# Altium project 4_3 LCD.PrjPcb
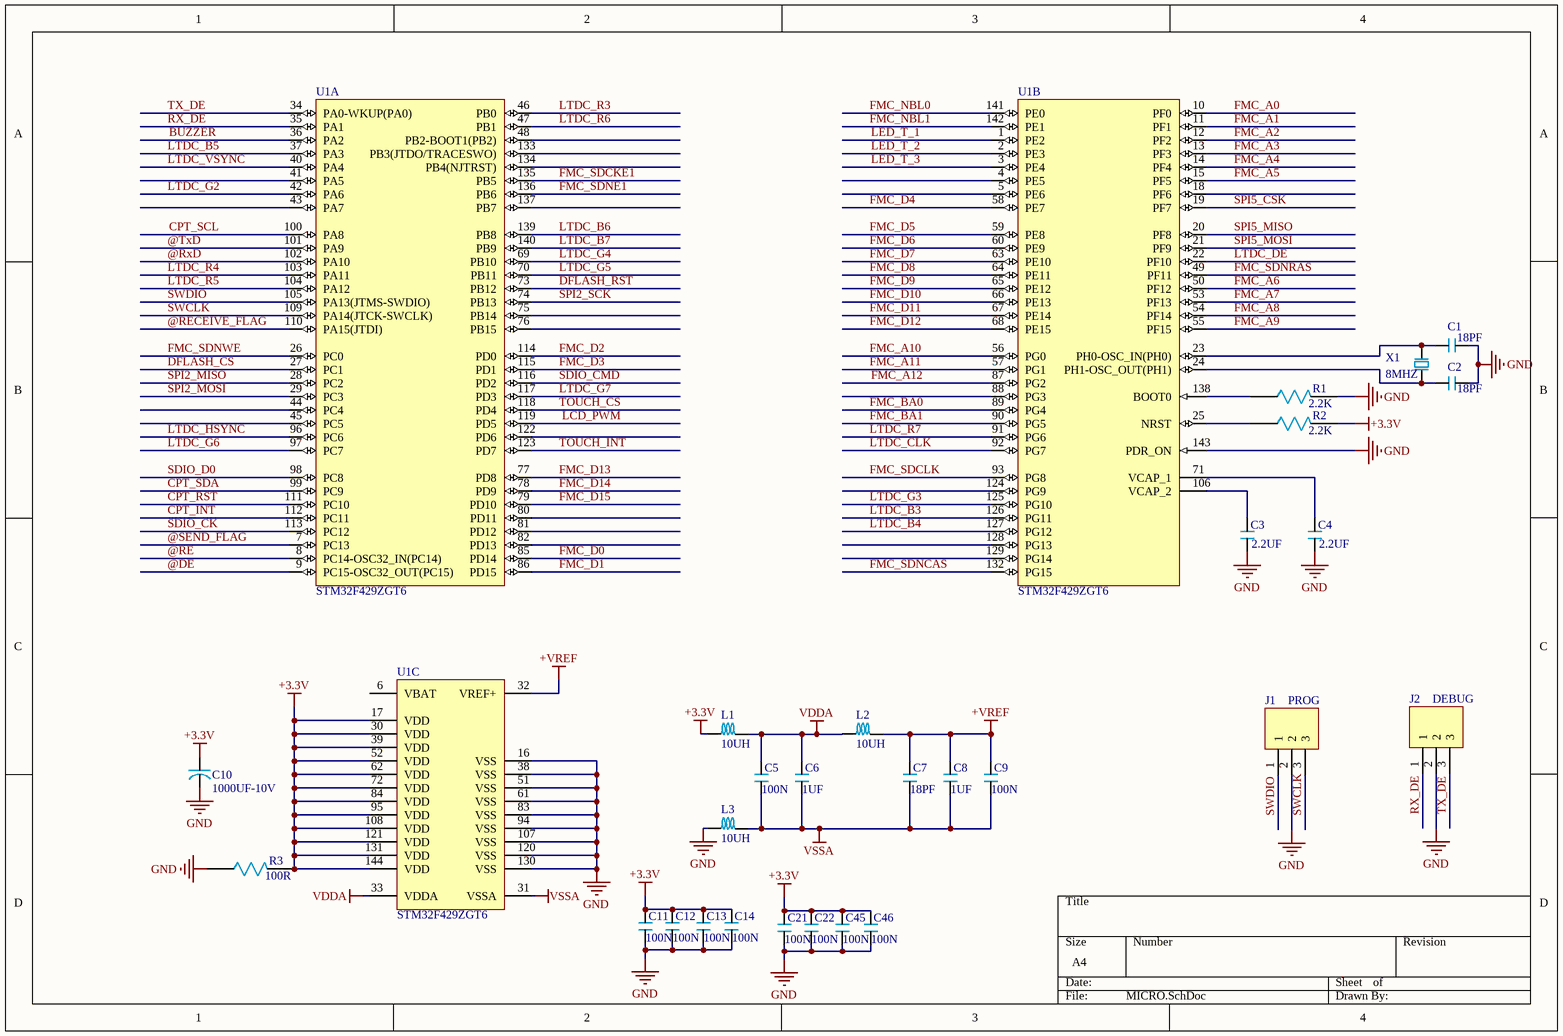
[diagram p0: MICRO.SchDoc]
6 sheets, 182 parts. Net scope: global (net labels, ports and power ports of the same name join across sheets).
Board file: LCD.PcbDoc
Sheets:
  MICRO.SchDoc
  SD_RAM.SchDoc
  NETWORK_RS485.SchDoc
  STORAGE.SchDoc
  LCD.SchDoc
  POWER.SchDoc

## Sheet MICRO.SchDoc
size A4; SheetNumber: 1; SheetTotal: 6

### Parts
C1  18PF  [0603]
C2  18PF  [0603]
C3  2.2UF  [1206]
C4  2.2UF  [1206]
C5  100N  [0603]
C6  1UF  [0603]
C7  18PF  [0603]
C8  1UF  [0603]
C9  100N  [0603]
C10  1000UF-10V  [RB.2/.4]
C11  100N  [0603]
C12  100N  [0603]
C13  100N  [0603]
C14  100N  [0603]
C21  100N  [0603]
C22  100N  [0603]
C45  100N  [0603]
C46  100N  [0603]
J1  PROG  [SIP3]
J2  DEBUG  [SIP3]
L1  10UH  [1206]
L2  10UH  [1206]
L3  10UH  [1206]
R1  2.2K  [0603]
R2  2.2K  [0603]
R3  100R  [1206]
U1  STM32F429ZGT6  [STM-LQFP144_N]  (parts A,B,C of 3)
X1  8MHZ  [XTAL_1]

### Nets
+3.3V: C10.1 C11.2 C12.2 C13.2 C14.2 C21.2 C22.2 C45.2 C46.2 L1.1 R2.2 R3.2 U1.17(VDD) U1.30(VDD) U1.39(VDD) U1.52(VDD) U1.62(VDD) U1.72(VDD) U1.84(VDD) U1.95(VDD) U1.108(VDD) U1.121(VDD) U1.131(VDD) U1.144(VDD)
+VREF: C7.2 C8.2 C9.2 L2.2 U1.32(VREF+)
GND: C1.2 C2.2 C3.1 C4.1 C10.2 C11.1 C12.1 C13.1 C14.1 C21.1 C22.1 C45.1 C46.1 J1.2 J2.2 L3.1 R1.2 R3.1 U1.16(VSS) U1.38(VSS) U1.51(VSS) U1.61(VSS) U1.83(VSS) U1.94(VSS) U1.107(VSS) U1.120(VSS) U1.130(VSS) U1.143(PDR_ON)
VDDA: C5.2 C6.2 L1.2 L2.1 U1.33(VDDA)
VSSA: C5.1 C6.1 C7.1 C8.1 C9.1 L3.2 U1.31(VSSA)
@DE: U1.9(PC15-OSC32_OUT(PC15))
@RE: U1.8(PC14-OSC32_IN(PC14))
@RECEIVE_FLAG: U1.110(PA15(JTDI))
@RxD: U1.102(PA10)
@SEND_FLAG: U1.7(PC13)
@TxD: U1.101(PA9)
BUZZER: U1.36(PA2)
CPT_INT: U1.112(PC11)
CPT_RST: U1.111(PC10)
CPT_SCL: U1.100(PA8)
CPT_SDA: U1.99(PC9)
DFLASH_CS: U1.27(PC1)
DFLASH_RST: U1.73(PB12)
FMC_A0: U1.10(PF0)
FMC_A1: U1.11(PF1)
FMC_A2: U1.12(PF2)
FMC_A3: U1.13(PF3)
FMC_A4: U1.14(PF4)
FMC_A5: U1.15(PF5)
FMC_A6: U1.50(PF12)
FMC_A7: U1.53(PF13)
FMC_A8: U1.54(PF14)
FMC_A9: U1.55(PF15)
FMC_A10: U1.56(PG0)
FMC_A11: U1.57(PG1)
FMC_A12: U1.87(PG2)
FMC_BA0: U1.89(PG4)
FMC_BA1: U1.90(PG5)
FMC_D0: U1.85(PD14)
FMC_D1: U1.86(PD15)
FMC_D2: U1.114(PD0)
FMC_D3: U1.115(PD1)
FMC_D4: U1.58(PE7)
FMC_D5: U1.59(PE8)
FMC_D6: U1.60(PE9)
FMC_D7: U1.63(PE10)
FMC_D8: U1.64(PE11)
FMC_D9: U1.65(PE12)
FMC_D10: U1.66(PE13)
FMC_D11: U1.67(PE14)
FMC_D12: U1.68(PE15)
FMC_D13: U1.77(PD8)
FMC_D14: U1.78(PD9)
FMC_D15: U1.79(PD10)
FMC_NBL0: U1.141(PE0)
FMC_NBL1: U1.142(PE1)
FMC_SDCKE1: U1.135(PB5)
FMC_SDCLK: U1.93(PG8)
FMC_SDNCAS: U1.132(PG15)
FMC_SDNE1: U1.136(PB6)
FMC_SDNRAS: U1.49(PF11)
FMC_SDNWE: U1.26(PC0)
LCD_PWM: U1.119(PD5)
LED_T_1: U1.1(PE2)
LED_T_2: U1.2(PE3)
LED_T_3: U1.3(PE4)
LTDC_B3: U1.126(PG11)
LTDC_B4: U1.127(PG12)
LTDC_B5: U1.37(PA3)
LTDC_B6: U1.139(PB8)
LTDC_B7: U1.140(PB9)
LTDC_CLK: U1.92(PG7)
LTDC_DE: U1.22(PF10)
LTDC_G2: U1.42(PA6)
LTDC_G3: U1.125(PG10)
LTDC_G4: U1.69(PB10)
LTDC_G5: U1.70(PB11)
LTDC_G6: U1.97(PC7)
LTDC_G7: U1.117(PD3)
LTDC_HSYNC: U1.96(PC6)
LTDC_R3: U1.46(PB0)
LTDC_R4: U1.103(PA11)
LTDC_R5: U1.104(PA12)
LTDC_R6: U1.47(PB1)
LTDC_R7: U1.91(PG6)
LTDC_VSYNC: U1.40(PA4)
RX_DE: J2.1 U1.35(PA1)
SDIO_CK: U1.113(PC12)
SDIO_CMD: U1.116(PD2)
SDIO_D0: U1.98(PC8)
SPI2_MISO: U1.28(PC2)
SPI2_MOSI: U1.29(PC3)
SPI2_SCK: U1.74(PB13)
SPI5_CSK: U1.19(PF7)
SPI5_MISO: U1.20(PF8)
SPI5_MOSI: U1.21(PF9)
SWCLK: J1.3 U1.109(PA14(JTCK-SWCLK))
SWDIO: J1.1 U1.105(PA13(JTMS-SWDIO))
TOUCH_CS: U1.118(PD4)
TOUCH_INT: U1.123(PD7)
TX_DE: J2.3 U1.34(PA0-WKUP(PA0))
NetC1_1: C1.1 U1.23(PH0-OSC_IN(PH0)) X1.2
NetC2_1: C2.1 U1.24(PH1-OSC_OUT(PH1)) X1.1
NetC3_2: C3.2 U1.106(VCAP_2)
NetC4_2: C4.2 U1.71(VCAP_1)
NetR1_1: R1.1 U1.138(BOOT0)
NetR2_1: R2.1 U1.25(NRST)

Not connected (* = marked no-connect by the designer): U1 4(PE5) 5(PE6) 6(VBAT) 18(PF6) 41(PA5) 43(PA7) 44(PC4) 45(PC5) 48(PB2-BOOT1(PB2)) 75(PB14) 76(PB15) 80(PD11) 81(PD12) 82(PD13) 88(PG3) 122(PD6) 124(PG9) 128(PG13) 129(PG14) 133(PB3(JTDO/TRACESWO)) 134(PB4(NJTRST)) 137(PB7)

### Library data of the parts
C1-C9 C11-C14 C21 C22 C45 C46 = CAP
C10 = CAP_POL
J1 J2 = SIP3
L1-L3 = SELF
R1-R3 = RES
U1 = STM32F429ZGT6: ARM Cortex-M4 32-bit MCU+FPU, 225 DMIPS, 1024 kB Flash, 256 kB Internal RAM, 114 I/Os, 144-pin LQFP, -40 to 85 degC, Tray; Manufacturer: STMicroelectronics; D/A Converter: 2x12-bit; FLASH Size (Prog) (kB): 1024; I/Os (High Current): 114; Internal RAM Size (kB): 256; Operating Frequency(F) (Processor speed) (MHz): 180; Supply Voltage(Vcc) max (V): 3.6; Supply Voltage(Vcc) min (V): 1.8; DatasheetVersion: Rev. 2; PackageVersion: Rev. 4, 06/2013; PackageReference: LQFP144; PackageDescription: 144-Pin Low Profile Quad Flat Package, 20 x 20 mm Body, 0.5 mm Pitch; Supplier 1: Digi-Key; Supplier Part Number 1: STM32F429ZGT6-ND; Supplier 2: Newark; Supplier Part Number 2: 06X3675; Supplier 3: Mouser; Supplier Part Number 3: 511-STM32F429ZGT6; Core: ARM Cortex-M4; Packing: Tray; Mounting Technology: Surface Mount; PartNumber: STM32F429ZGT6; ComponentLink1Description: Manufacturer URL; ComponentLink1URL: http://www.st.com/web/en/home.html; ComponentLink2Description: Datasheet; ComponentLink2URL: http://www.st.com/st-web-ui/static/active/en/resource/technical/document/data_brief/DM00053488.pdf; ComponentLink3Description: Package Specification; ComponentLink3URL: http://www.st.com/st-web-ui/static/active/en/resource/technical/document/datasheet/DM00037051.pdf
X1 = XTAL

## Sheet SD_RAM.SchDoc
size A4; SheetNumber: 2; SheetTotal: 6
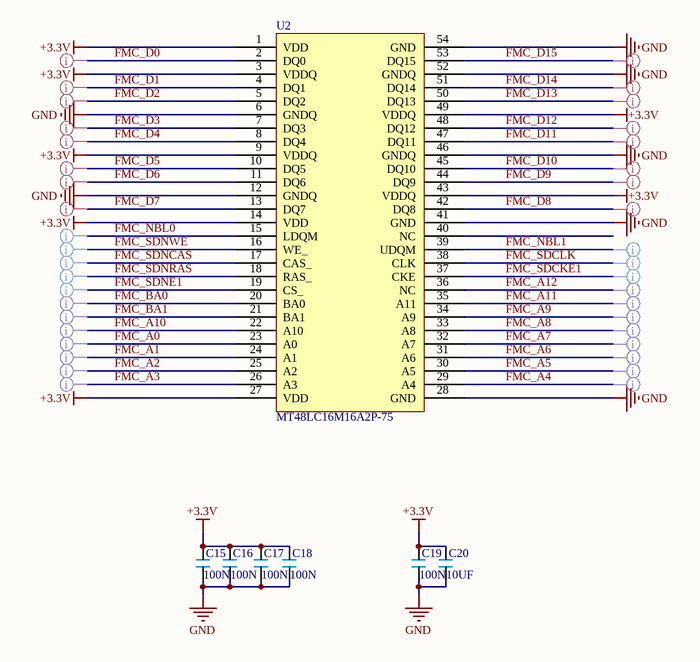
[diagram p1: SD_RAM.SchDoc]

### Parts
C15  100N  [0603]
C16  100N  [0603]
C17  100N  [0603]
C18  100N  [0603]
C19  100N  [0603]
C20  10UF  [0603]
U2  MT48LC16M16A2P-75  [TSOP-54]

### Nets
+3.3V: C15.2 C16.2 C17.2 C18.2 C19.2 C20.2 U2.1(VDD) U2.3(VDDQ) U2.9(VDDQ) U2.14(VDD) U2.27(VDD) U2.43(VDDQ) U2.49(VDDQ)
GND: C15.1 C16.1 C17.1 C18.1 C19.1 C20.1 U2.6(GNDQ) U2.12(GNDQ) U2.28(GND) U2.41(GND) U2.46(GNDQ) U2.52(GNDQ) U2.54(GND)
FMC_A0: U2.23(A0)
FMC_A1: U2.24(A1)
FMC_A2: U2.25(A2)
FMC_A3: U2.26(A3)
FMC_A4: U2.29(A4)
FMC_A5: U2.30(A5)
FMC_A6: U2.31(A6)
FMC_A7: U2.32(A7)
FMC_A8: U2.33(A8)
FMC_A9: U2.34(A9)
FMC_A10: U2.22(A10)
FMC_A11: U2.35(A11)
FMC_A12: U2.36(NC)
FMC_BA0: U2.20(BA0)
FMC_BA1: U2.21(BA1)
FMC_D0: U2.2(DQ0)
FMC_D1: U2.4(DQ1)
FMC_D2: U2.5(DQ2)
FMC_D3: U2.7(DQ3)
FMC_D4: U2.8(DQ4)
FMC_D5: U2.10(DQ5)
FMC_D6: U2.11(DQ6)
FMC_D7: U2.13(DQ7)
FMC_D8: U2.42(DQ8)
FMC_D9: U2.44(DQ9)
FMC_D10: U2.45(DQ10)
FMC_D11: U2.47(DQ11)
FMC_D12: U2.48(DQ12)
FMC_D13: U2.50(DQ13)
FMC_D14: U2.51(DQ14)
FMC_D15: U2.53(DQ15)
FMC_NBL0: U2.15(LDQM)
FMC_NBL1: U2.39(UDQM)
FMC_SDCKE1: U2.37(CKE)
FMC_SDCLK: U2.38(CLK)
FMC_SDNCAS: U2.17(CAS_)
FMC_SDNE1: U2.19(CS_)
FMC_SDNRAS: U2.18(RAS_)
FMC_SDNWE: U2.16(WE_)

Not connected (* = marked no-connect by the designer): U2 40(NC)

### Layout directives
net class FMC_DATA: FMC_D0, FMC_D1, FMC_D2, FMC_D3, FMC_D4, FMC_D5, FMC_D6, FMC_D7, FMC_D8, FMC_D9, FMC_D10, FMC_D11, FMC_D12, FMC_D13, FMC_D14, FMC_D15
net class FMC_ADDRESS: FMC_A0, FMC_A1, FMC_A2, FMC_A3, FMC_A4, FMC_A5, FMC_A6, FMC_A7, FMC_A8, FMC_A9, FMC_A10, FMC_A11, FMC_A12, FMC_BA0, FMC_BA1
net class FMC_COMMAND: FMC_NBL0, FMC_NBL1, FMC_SDCKE1, FMC_SDCLK, FMC_SDNCAS, FMC_SDNE1, FMC_SDNRAS, FMC_SDNWE

### Library data of the parts
C15-C20 = CAP

## Sheet NETWORK_RS485.SchDoc
size A4; SheetNumber: 3; SheetTotal: 6
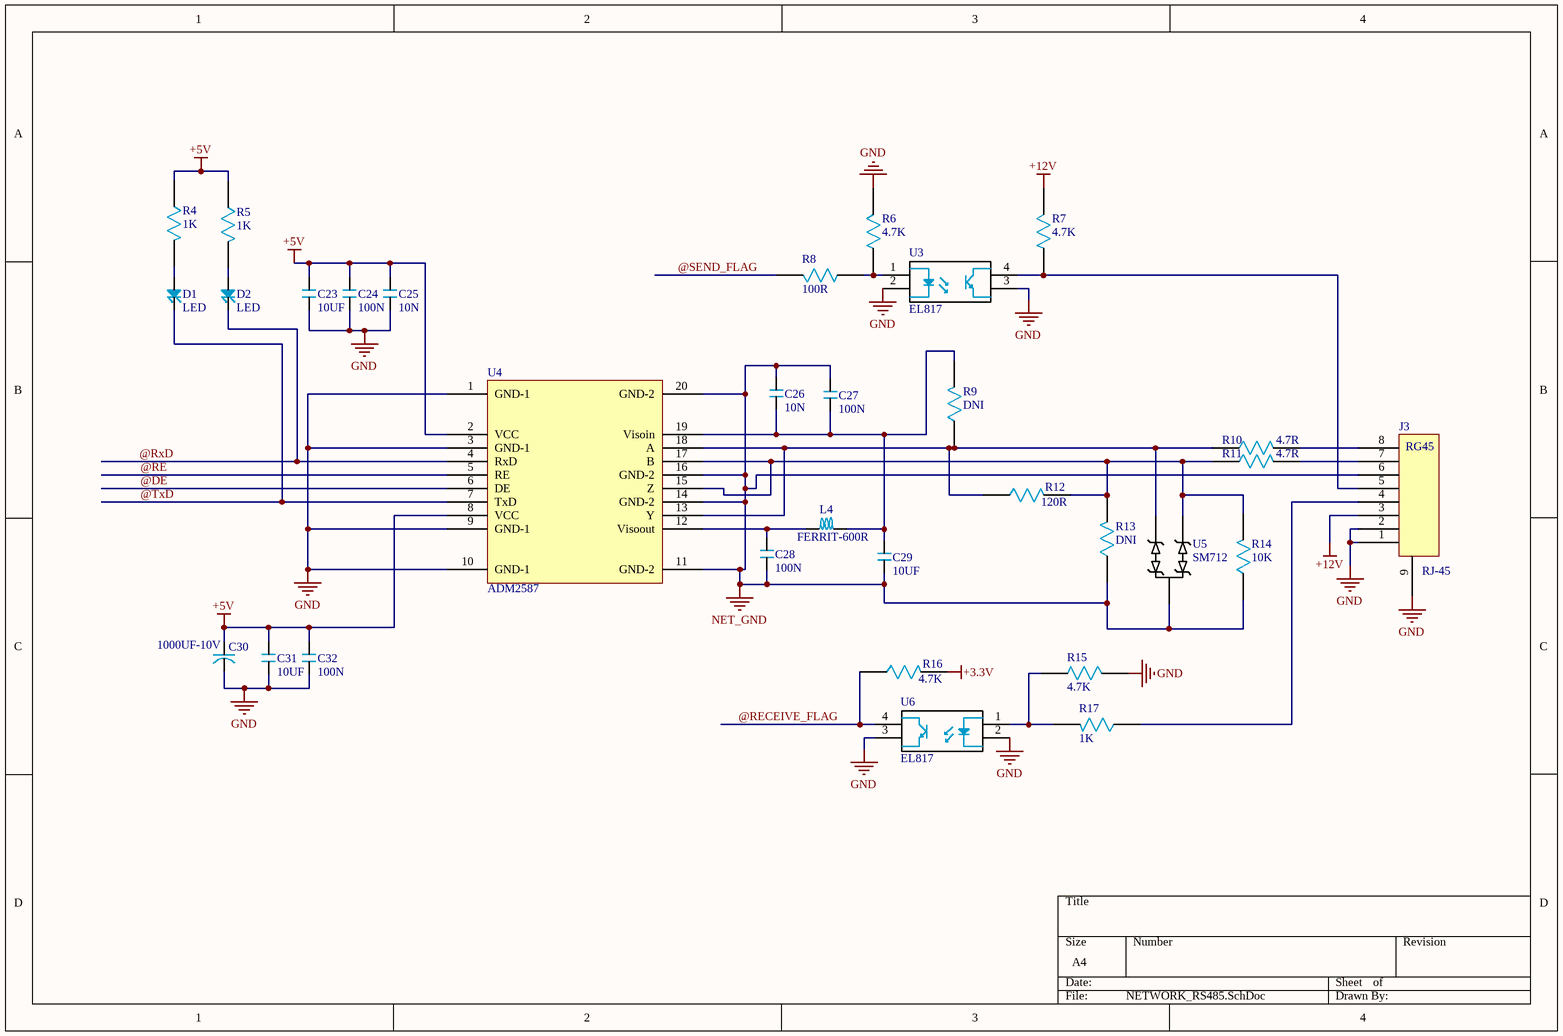
[diagram p2: NETWORK_RS485.SchDoc]

### Parts
C23  10UF  [0603]
C24  100N  [0603]
C25  10N  [0603]
C26  10N  [1206]
C27  100N  [1206]
C28  100N  [1206]
C29  10UF  [1206]
C30  1000UF-10V  [RB.2/.4]
C31  10UF  [0603]
C32  100N  [0603]
D1  LED  [0603]
D2  LED  [0603]
J3  RJ-45  [RJ-45]
L4  FERRIT-600R  [1206]
R4  1K  [0603]
R5  1K  [0603]
R6  4.7K  [1206]
R7  4.7K  [1206]
R8  100R  [1206]
R9  DNI  [1206]
R10  4.7R  [1206]
R11  4.7R  [1206]
R12  120R  [1206]
R13  DNI  [1206]
R14  10K  [1206]
R15  4.7K  [1206]
R16  4.7K  [1206]
R17  1K  [1206]
U3  EL817  [DIP4]
U4  ADM2587  [SOIC20_W]
U5  SM712  [SOT-23]
U6  EL817  [DIP4]

### Nets
+3.3V: R16.2
+5V: C23.2 C24.2 C25.1 C30.1 C31.2 C32.2 R4.1 R5.1 U4.2(VCC) U4.8(VCC)
+12V: J3.3 R7.1
GND: C23.1 C24.1 C25.2 C30.2 C31.1 C32.1 J3.1 J3.2 J3.9 R6.1 R15.1 U3.2 U3.3 U4.1(GND-1) U4.3(GND-1) U4.9(GND-1) U4.10(GND-1) U6.2 U6.3
NET_GND: C26.1 C27.2 C28.2 C29.1 J3.6 R13.1 R14.1 U4.11(GND-2) U4.14(GND-2) U4.16(GND-2) U4.20(GND-2) U5.3
@DE: U4.6(DE)
@RE: U4.5(RE)
@RECEIVE_FLAG: R16.1 U6.4
@RxD: D2.2 U4.4(RxD)
@SEND_FLAG: R8.1
@TxD: D1.2 U4.7(TxD)
NetC26_2: C26.2 C27.1 C29.2 L4.2 R9.2 U4.19(Visoin)
NetC28_1: C28.1 L4.1 U4.12(Visoout)
NetD1_1: D1.1 R4.2
NetD2_1: D2.1 R5.2
NetJ3_4: J3.4 R17.1
NetJ3_5: J3.5 R7.2 U3.4
NetJ3_7: J3.7 R11.2
NetJ3_8: J3.8 R10.2
NetR6_2: R6.2 R8.2 U3.1
NetR9_1: R9.1 R10.1 R12.1 U4.13(Y) U4.18(A) U5.1
NetR11_1: R11.1 R12.2 R13.2 R14.2 U4.15(Z) U4.17(B) U5.2
NetR15_2: R15.2 R17.2 U6.1

### Notes on the sheet
- (in symbol RJ-45) RG45

### Library data of the parts
C23-C29 C31 C32 = CAP
C30 = CAP_POL
L4 = SELF
R4-R17 = RES
U3 U6 = TLP521
U4 = AMD2582

## Sheet STORAGE.SchDoc
size A4; SheetNumber: 4; SheetTotal: 6
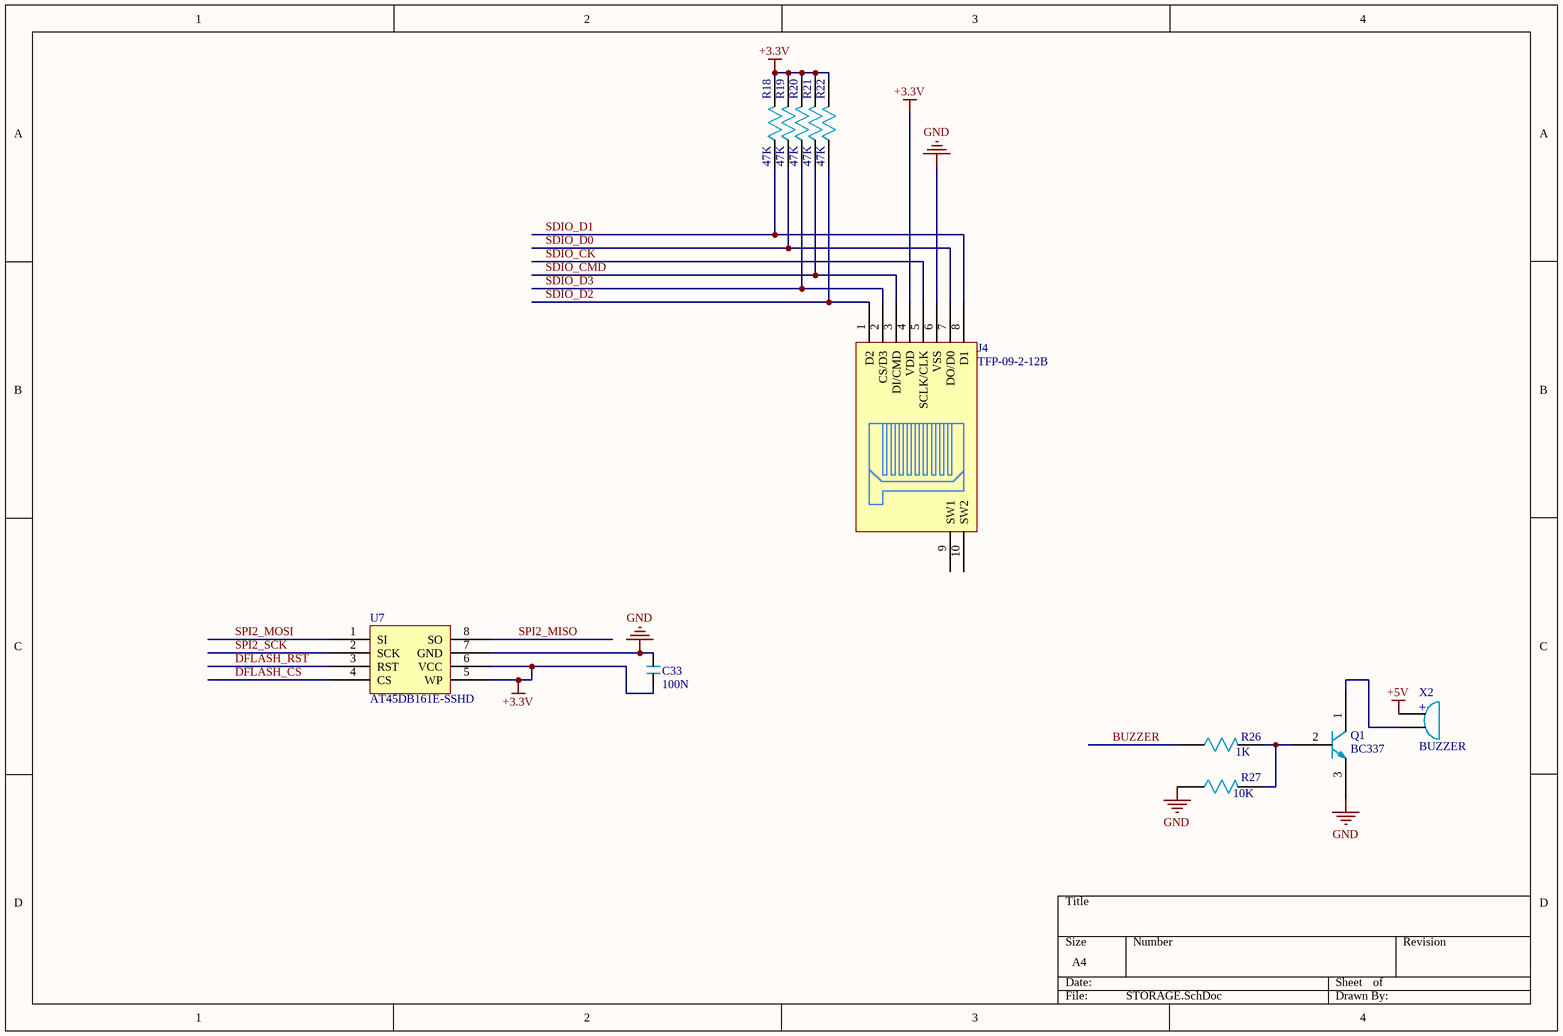
[diagram p3: STORAGE.SchDoc]

### Parts
C33  100N  [0603]
J4  TFP-09-2-12B  [TFP-09-2-12B]
Q1  BC337  [BC337]
R18  47K  [0603]
R19  47K  [0603]
R20  47K  [0603]
R21  47K  [0603]
R22  47K  [0603]
R26  1K  [0603]
R27  10K  [0603]
U7  AT45DB161E-SSHD  [8S2]
X2  BUZZER  [BUZZER]

### Nets
+3.3V: C33.2 J4.4(VDD) R18.2 R19.2 R20.2 R21.2 R22.2 U7.5(WP) U7.6(VCC)
+5V: X2.1(VCC)
GND: C33.1 J4.6(VSS) Q1.3 R27.1 U7.7(GND)
BUZZER: R26.1
DFLASH_CS: U7.4(CS)
DFLASH_RST: U7.3(RST)
SDIO_CK: J4.5(SCLK/CLK)
SDIO_CMD: J4.3(DI/CMD) R21.1
SDIO_D0: J4.7(DO/D0) R19.1
SDIO_D1: J4.8(D1) R18.1
SDIO_D2: J4.1(D2) R22.1
SDIO_D3: J4.2(CS/D3) R20.1
SPI2_MISO: U7.8(SO)
SPI2_MOSI: U7.1(SI)
SPI2_SCK: U7.2(SCK)
NetQ1_1: Q1.1 X2.2(GND)
NetQ1_2: Q1.2 R26.2 R27.2

Not connected (* = marked no-connect by the designer): J4 9(SW1) 10(SW2)

### Notes on the sheet
- (in symbol BUZZER) +

### Library data of the parts
C33 = CAP
J4 = uSD
Q1 = NPN-SMD
R18-R22 R26 R27 = RES

## Sheet LCD.SchDoc
size 381 x 241 mm; SheetNumber: 5; SheetTotal: 6
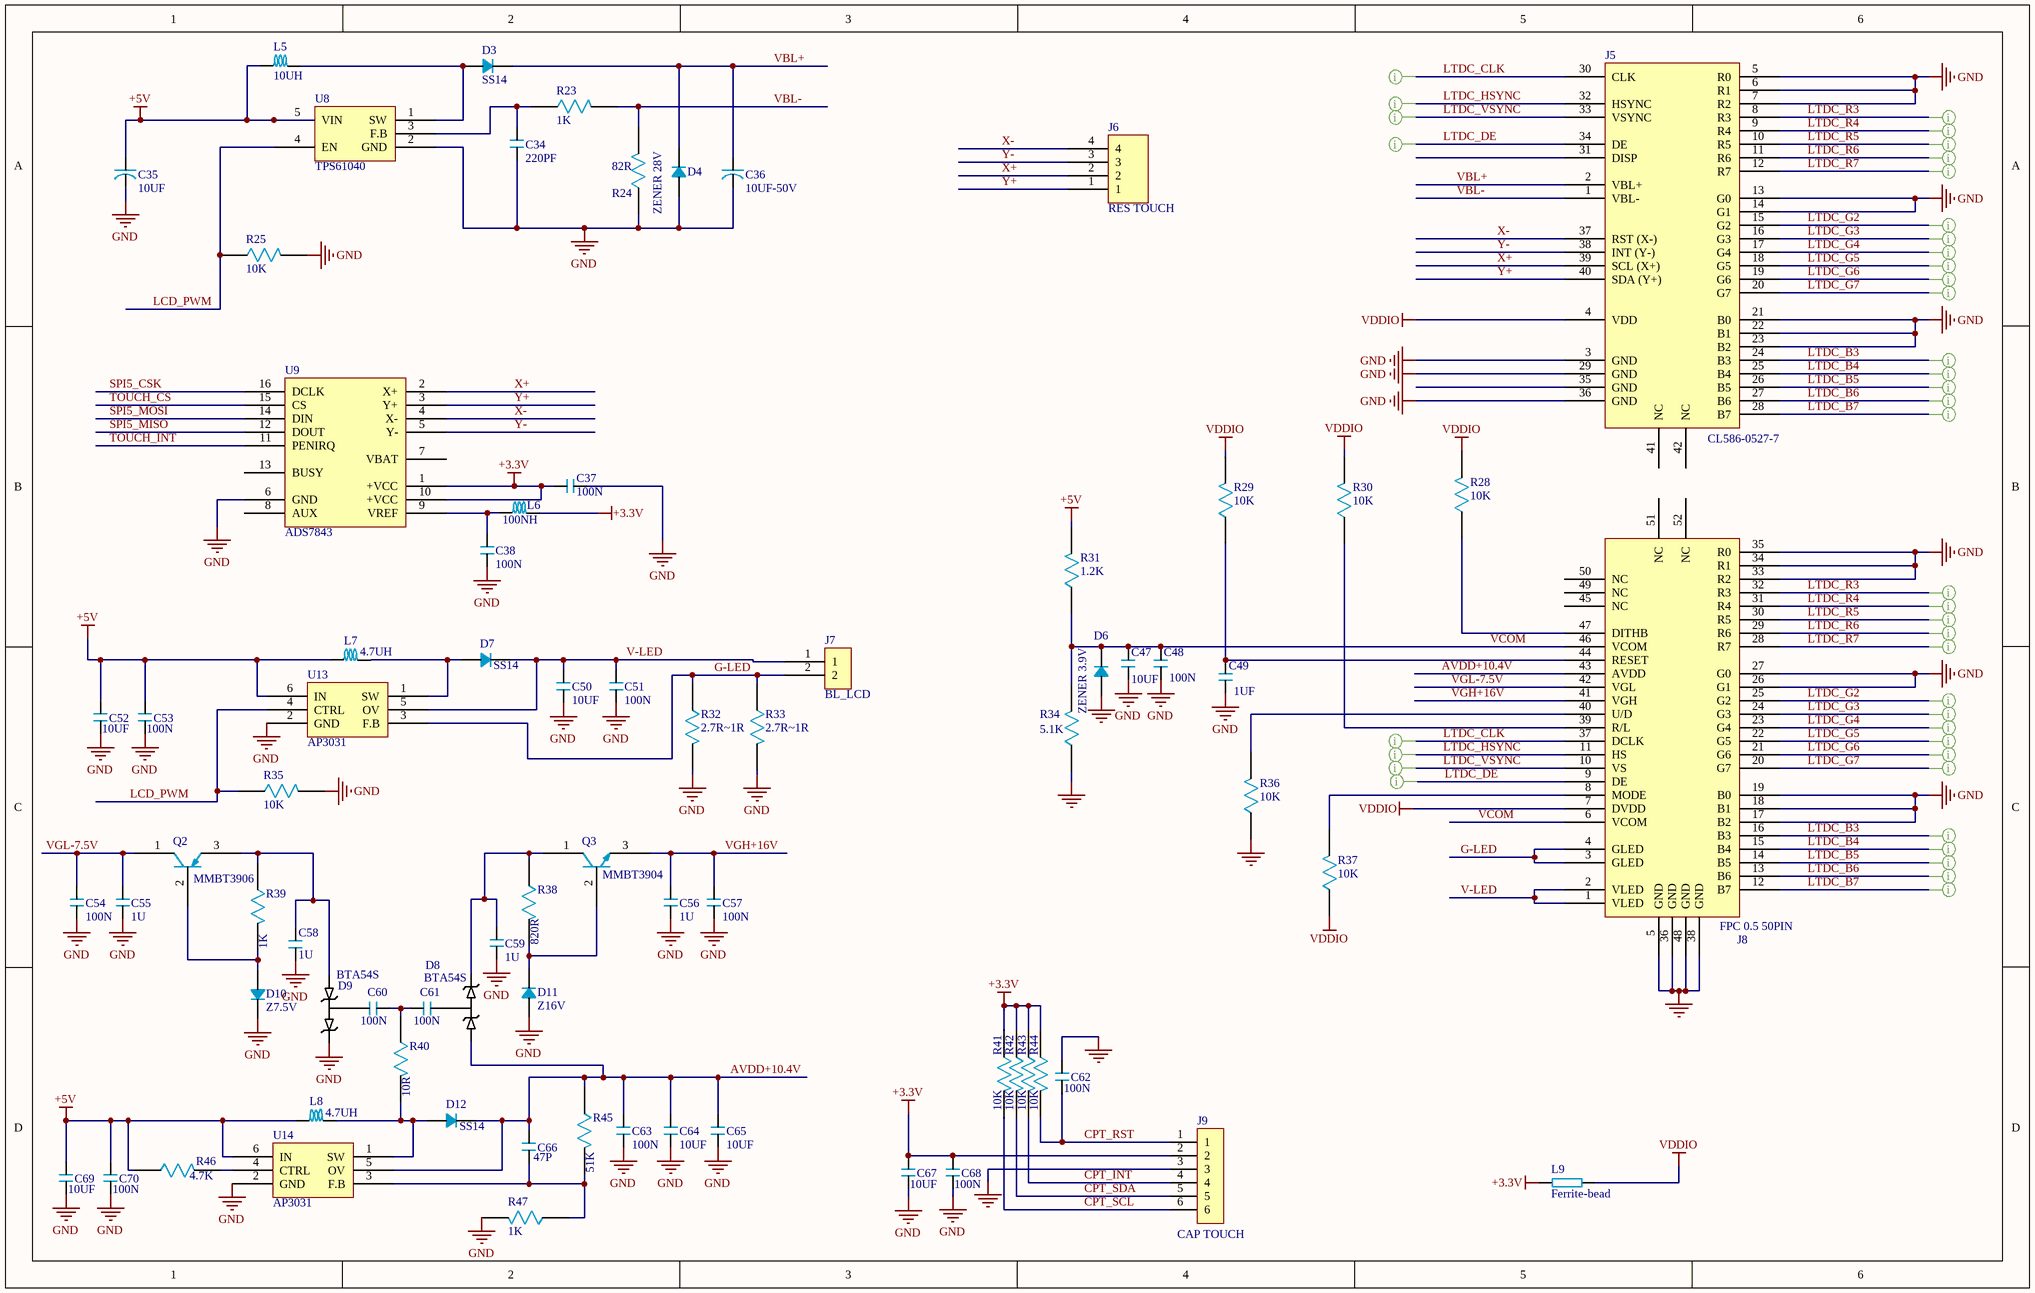
[diagram p4: LCD.SchDoc]

### Parts
C34  220PF  [1206]
C35  10UF  [1206]
C36  10UF-50V  [RB.1/.3]
C37  100N  [0603]
C38  100N  [0603]
C47  10UF  [0603]
C48  100N  [0603]
C49  1UF  [0603]
C50  10UF  [0603]
C51  100N  [0603]
C52  10UF  [0603]
C53  100N  [0603]
C54  100N  [0603]
C55  1U  [0603]
C56  1U  [0603]
C57  100N  [0603]
C58  1U  [0603]
C59  1U  [0603]
C60  100N  [0603]
C61  100N  [0603]
C62  100N  [0603]
C63  100N  [0603]
C64  10UF  [0603]
C65  10UF  [0603]
C66  47P  [0603]
C67  10UF  [0603]
C68  100N  [0603]
C69  10UF  [0603]
C70  100N  [0603]
D3  SS14  [SOD-123-B]
D4  ZENER 28V  [SOD-123]
D6  ZENER 3.9V  [SOD-123]
D7  SS14  [SOD-123-B]
D8  BTA54S  [SOT-23]
D9  BTA54S  [SOT-23]
D10  Z7.5V  [MINI-MELF]
D11  Z16V  [MINI-MELF]
D12  SS14  [SOD-123-B]
J5  CL586-0527-7  [PFC-40]
J6  RES TOUCH  [4PIN-1.5MM-SMD]
J7  BL_LCD  [BL_LCD]
J8  FPC 0.5 50PIN  [PFC-50]
J9  CAP TOUCH  [FPC-6-TOP-1MM]
L5  10UH  [SELF_7MM]
L6  100NH  [1206]
L7  4.7UH  [SELF_7MM]
L8  4.7UH  [SELF_7MM]
L9  Ferrite-bead  [0805]
Q2  MMBT3906  [BC337]
Q3  MMBT3904  [BC337]
R23  1K  [1206]
R24  82R  [1206]
R25  10K  [1206]
R28  10K  [0603]
R29  10K  [0603]
R30  10K  [0603]
R31  1.2K  [0603]
R32  2.7R~1R  [0603]
R33  2.7R~1R  [0603]
R34  5.1K  [0603]
R35  10K  [0603]
R36  10K  [0603]
R37  10K  [0603]
R38  820R  [0603]
R39  1K  [0603]
R40  10R  [0603]
R41  10K  [0603]
R42  10K  [0603]
R43  10K  [0603]
R44  10K  [0603]
R45  51K  [0603]
R46  4.7K  [0603]
R47  1K  [0603]
U8  TPS61040  [SOT23-5]
U9  ADS7843  [TSSOP-16]
U13  AP3031  [SOT23-6]
U14  AP3031  [SOT23-6]

### Nets
+3.3V: C37.2 C67.1 C68.1 J9.2 L6.2 L9.1 R41.1 R42.1 R43.1 R44.1 U9.1(+VCC) U9.10(+VCC)
+5V: C35.1 C52.1 C53.1 C69.1 C70.1 L5.1 L7.1 L8.1 R31.2 R46.1 U8.5(VIN) U13.6(IN) U14.6(IN)
GND: C34.1 C35.2 C36.2 C37.1 C38.1 C47.2 C48.2 C49.2 C50.2 C51.2 C52.2 C53.2 C54.2 C55.2 C56.2 C57.2 C58.2 C59.2 C62.1 C63.2 C64.2 C65.2 C67.2 C68.2 C69.2 C70.2 D4.1 D6.1 D9.2 D10.2 D11.1 J5.3(GND) J5.5(R0) J5.6(R1) J5.7(R2) J5.13(G0) J5.14(G1) J5.21(B0) J5.22(B1) J5.23(B2) J5.29(GND) J5.36(GND) J8.5(GND) J8.17(B2) J8.18(B1) J8.19(B0) J8.26(G1) J8.27(G0) J8.33(R2) J8.34(R1) J8.35(R0) J8.36(GND) J8.38(GND) J8.48(GND) J9.3 R24.1 R25.2 R32.2 R33.2 R34.1 R35.2 R36.1 R47.2 U8.2(GND) U9.6(GND) U13.2(GND) U14.2(GND)
VDDIO: J5.4(VDD) J8.7(DVDD) L9.2 R28.2 R29.2 R30.2 R37.1
AVDD+10.4V: C63.1 C64.1 C65.1 C66.1 D8.1 D12.2 J8.43(AVDD) R45.1 U14.5(OV)
CPT_INT: J9.4 R43.2
CPT_RST: C62.2 J9.1 R44.2
CPT_SCL: J9.6 R41.2
CPT_SDA: J9.5 R42.2
G-LED: J7.2 J8.3(GLED) J8.4(GLED) R32.1 R33.1 U13.3(F.B)
LCD_PWM: R25.1 R35.1 U8.4(EN) U13.4(CTRL)
LTDC_B3: J5.24(B3) J8.16(B3)
LTDC_B4: J5.25(B4) J8.15(B4)
LTDC_B5: J5.26(B5) J8.14(B5)
LTDC_B6: J5.27(B6) J8.13(B6)
LTDC_B7: J5.28(B7) J8.12(B7)
LTDC_CLK: J5.30(CLK) J8.37(DCLK)
LTDC_DE: J5.34(DE) J8.9(DE)
LTDC_G2: J5.15(G2) J8.25(G2)
LTDC_G3: J5.16(G3) J8.24(G3)
LTDC_G4: J5.17(G4) J8.23(G4)
LTDC_G5: J5.18(G5) J8.22(G5)
LTDC_G6: J5.19(G6) J8.21(G6)
LTDC_G7: J5.20(G7) J8.20(G7)
LTDC_HSYNC: J5.32(HSYNC) J8.11(HS)
LTDC_R3: J5.8(R3) J8.32(R3)
LTDC_R4: J5.9(R4) J8.31(R4)
LTDC_R5: J5.10(R5) J8.30(R5)
LTDC_R6: J5.11(R6) J8.29(R6)
LTDC_R7: J5.12(R7) J8.28(R7)
LTDC_VSYNC: J5.33(VSYNC) J8.10(VS)
SPI5_CSK: U9.16(DCLK)
SPI5_MISO: U9.12(DOUT)
SPI5_MOSI: U9.14(DIN)
TOUCH_CS: U9.15(CS)
TOUCH_INT: U9.11(PENIRQ)
V-LED: C50.1 C51.1 D7.2 J7.1 J8.1(VLED) J8.2(VLED) U13.5(OV)
VBL+: C36.1 D3.2 D4.2 J5.2(VBL+)
VBL-: J5.1(VBL-) R23.2 R24.2
VCOM: C47.1 C48.1 D6.2 J8.6(VCOM) J8.46(VCOM) R31.1 R34.2
VGH+16V: C56.1 C57.1 J8.41(VGH) Q3.3
VGL-7.5V: C54.1 C55.1 J8.42(VGL) Q2.1
X+: J5.39(SCL_(X+)) J6.2 U9.2(X+)
X-: J5.37(RST_(X-)) J6.4 U9.4(X-)
Y+: J5.40(SDA_(Y+)) J6.1 U9.3(Y+)
Y-: J5.38(INT_(Y-)) J6.3 U9.5(Y-)
NetC34_2: C34.2 R23.1 U8.3(F.B)
NetC38_2: C38.2 L6.1 U9.9(VREF)
NetC49_1: C49.1 J8.44(RESET) R29.1
NetC58_1: C58.1 D9.1 Q2.3 R39.1
NetC59_1: C59.1 D8.2 Q3.1 R38.1
NetC60_1: C60.1 D9.3
NetC60_2: C60.2 C61.1 R40.1
NetC61_2: C61.2 D8.3
NetC66_2: C66.2 R45.2 R47.1 U14.3(F.B)
NetD3_1: D3.1 L5.2 U8.1(SW)
NetD7_1: D7.1 L7.2 U13.1(SW)
NetD10_1: D10.1 Q2.2 R39.2
NetD11_2: D11.2 Q3.2 R38.2
NetD12_1: D12.1 L8.2 R40.2 U14.1(SW)
NetJ8_8: J8.8(MODE) R37.2
NetJ8_39: J8.39(R/L) R30.1
NetJ8_40: J8.40(U/D) R36.2
NetJ8_47: J8.47(DITHB) R28.1
NetR46_2: R46.2 U14.4(CTRL)

Not connected (* = marked no-connect by the designer): J5 31(DISP) 35(GND) 41(NC) 42(NC); J8 45(NC) 49(NC) 50(NC) 51(NC) 52(NC); U9 7(VBAT) 8(AUX) 13(BUSY)

### Layout directives
net class LTDC: LTDC_B3, LTDC_B4, LTDC_B5, LTDC_B6, LTDC_B7, LTDC_CLK, LTDC_DE, LTDC_G2, LTDC_G3, LTDC_G4, LTDC_G5, LTDC_G6, LTDC_G7, LTDC_HSYNC, LTDC_R3, LTDC_R4, LTDC_R5, LTDC_R6, LTDC_R7, LTDC_VSYNC

### Library data of the parts
C34 C37 C38 C47-C70 = CAP
C35 C36 = CAP_POL
D3 D4 D6 D7 D10-D12 = DIODE
J5 = FPC 0.5 40PIN
J6 = 4-PIN
J9 = FPC-6-TOP-1MM
L5-L8 = SELF
Q2 = PNP-SMD
Q3 = NPN-SMD
R23-R25 R28-R47 = RES

## Sheet POWER.SchDoc
size A4; SheetNumber: 6; SheetTotal: 6
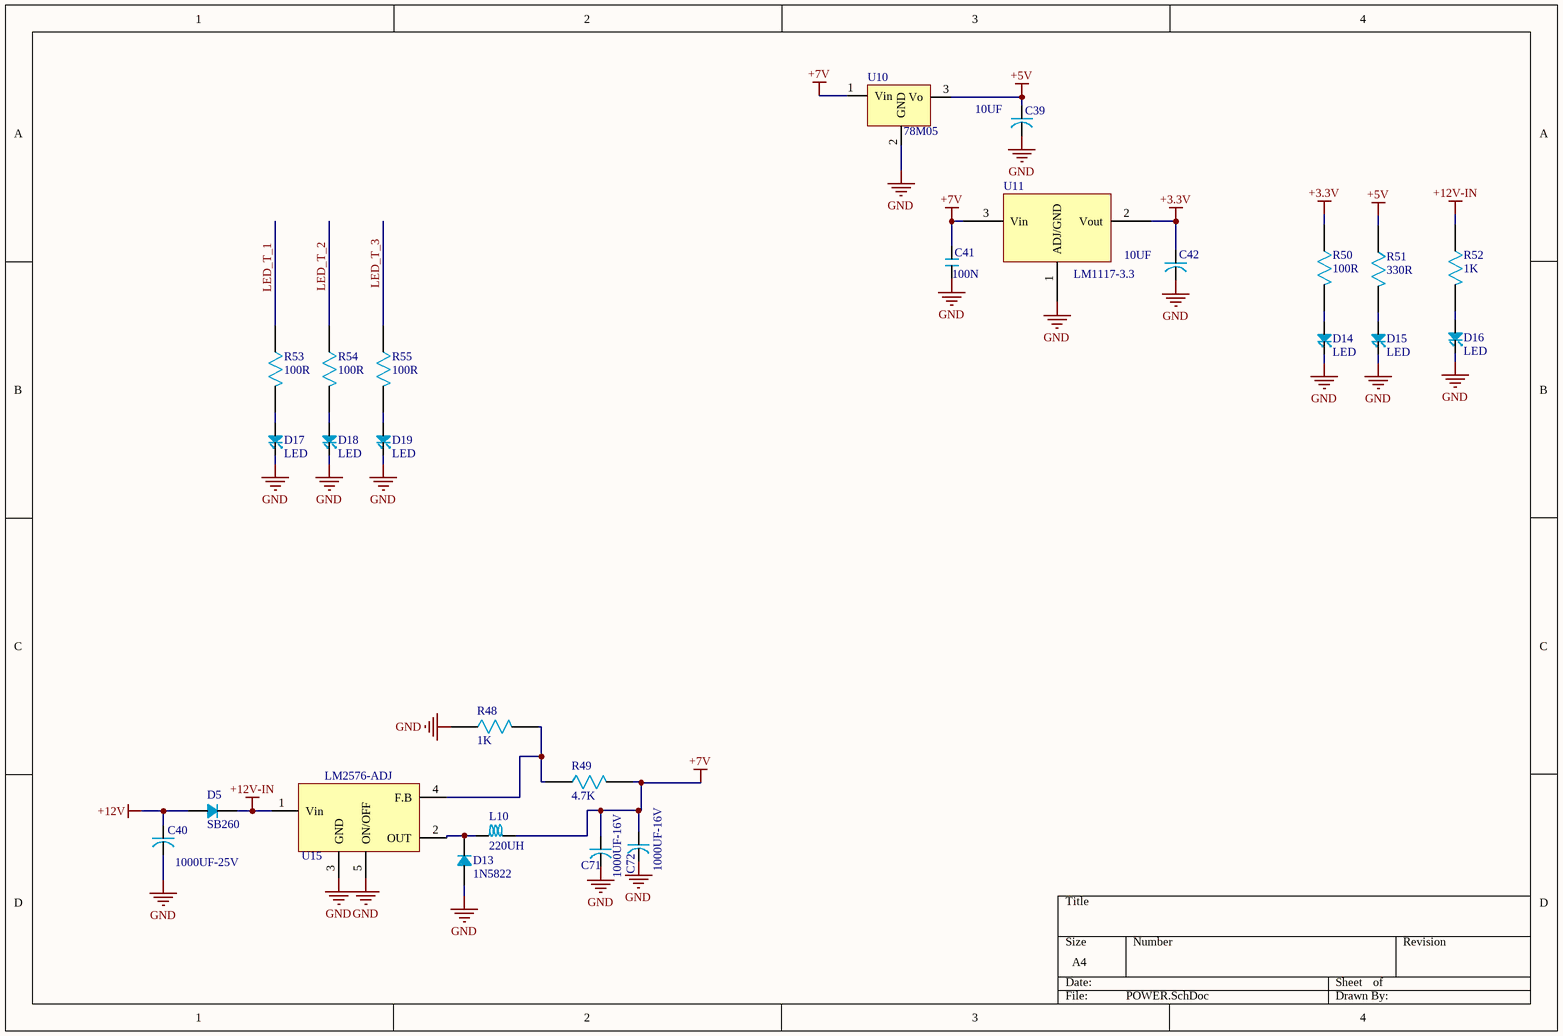
[diagram p5: POWER.SchDoc]

### Parts
C39  10UF  [1206]
C40  1000UF-25V  [RB.2/.4]
C41  100N  [1206]
C42  10UF  [1206]
C71  1000UF-16V  [RB.2/.4]
C72  1000UF-16V  [RB.2/.4]
D5  SB260  [DIODE0.1]
D13  1N5822  [SOD-123-B]
D14  LED  [0603]
D15  LED  [0603]
D16  LED  [0603]
D17  LED  [0603]
D18  LED  [0603]
D19  LED  [0603]
L10  220UH  [SELF_SMD_CD75]
R48  1K  [1206]
R49  4.7K  [1206]
R50  100R  [0603]
R51  330R  [0603]
R52  1K  [0603]
R53  100R  [0603]
R54  100R  [0603]
R55  100R  [0603]
U10  78M05  [DPAK]
U11  LM1117-3.3  [TO-252]
U15  LM2576-ADJ  [CASE936A]

### Nets
+3.3V: C42.1 R50.1 U11.2(Vout)
+5V: C39.1 R51.1 U10.3(Vo)
+7V: C41.2 C71.1 C72.1 L10.2 R49.2 U10.1(Vin) U11.3(Vin)
+12V: C40.1 D5.1
+12V-IN: D5.2 R52.1 U15.1(Vin)
GND: C39.2 C40.2 C41.1 C42.2 C71.2 C72.2 D13.1 D14.2 D15.2 D16.2 D17.2 D18.2 D19.2 R48.1 U10.2(GND) U11.1(ADJ/GND) U15.3(GND) U15.5(ON/OFF)
LED_T_1: R53.1
LED_T_2: R54.1
LED_T_3: R55.1
NetD13_2: D13.2 L10.1 U15.2(OUT)
NetD14_1: D14.1 R50.2
NetD15_1: D15.1 R51.2
NetD16_1: D16.1 R52.2
NetD17_1: D17.1 R53.2
NetD18_1: D18.1 R54.2
NetD19_1: D19.1 R55.2
NetR48_2: R48.2 R49.1 U15.4(F.B)

### Library data of the parts
C39 C40 C42 C71 C72 = CAP_POL
C41 = CAP
D5 D13 = DIODE
L10 = SELF
R48-R55 = RES
U10 = REG
U11 = LM1117
U15 = LM2576

## Nets that join several sheets
+3.3V: MICRO (24 pins), SD_RAM (13 pins), NETWORK_RS485 (R16.2), STORAGE (9 pins), LCD (12 pins), POWER (C42.1 R50.1 U11.2)
+5V: NETWORK_RS485 (10 pins), STORAGE (X2.1), LCD (13 pins), POWER (C39.1 R51.1 U10.3)
+12V: NETWORK_RS485 (J3.3 R7.1), POWER (C40.1 D5.1)
GND: MICRO (28 pins), SD_RAM (13 pins), NETWORK_RS485 (19 pins), STORAGE (5 pins), LCD (67 pins), POWER (18 pins)
@DE: MICRO (U1.9), NETWORK_RS485 (U4.6)
@RE: MICRO (U1.8), NETWORK_RS485 (U4.5)
@RECEIVE_FLAG: MICRO (U1.110), NETWORK_RS485 (R16.1 U6.4)
@RxD: MICRO (U1.102), NETWORK_RS485 (D2.2 U4.4)
@SEND_FLAG: MICRO (U1.7), NETWORK_RS485 (R8.1)
@TxD: MICRO (U1.101), NETWORK_RS485 (D1.2 U4.7)
BUZZER: MICRO (U1.36), STORAGE (R26.1)
CPT_INT: MICRO (U1.112), LCD (J9.4 R43.2)
CPT_RST: MICRO (U1.111), LCD (C62.2 J9.1 R44.2)
CPT_SCL: MICRO (U1.100), LCD (J9.6 R41.2)
CPT_SDA: MICRO (U1.99), LCD (J9.5 R42.2)
DFLASH_CS: MICRO (U1.27), STORAGE (U7.4)
DFLASH_RST: MICRO (U1.73), STORAGE (U7.3)
FMC_A0: MICRO (U1.10), SD_RAM (U2.23)
FMC_A1: MICRO (U1.11), SD_RAM (U2.24)
FMC_A2: MICRO (U1.12), SD_RAM (U2.25)
FMC_A3: MICRO (U1.13), SD_RAM (U2.26)
FMC_A4: MICRO (U1.14), SD_RAM (U2.29)
FMC_A5: MICRO (U1.15), SD_RAM (U2.30)
FMC_A6: MICRO (U1.50), SD_RAM (U2.31)
FMC_A7: MICRO (U1.53), SD_RAM (U2.32)
FMC_A8: MICRO (U1.54), SD_RAM (U2.33)
FMC_A9: MICRO (U1.55), SD_RAM (U2.34)
FMC_A10: MICRO (U1.56), SD_RAM (U2.22)
FMC_A11: MICRO (U1.57), SD_RAM (U2.35)
FMC_A12: MICRO (U1.87), SD_RAM (U2.36)
FMC_BA0: MICRO (U1.89), SD_RAM (U2.20)
FMC_BA1: MICRO (U1.90), SD_RAM (U2.21)
FMC_D0: MICRO (U1.85), SD_RAM (U2.2)
FMC_D1: MICRO (U1.86), SD_RAM (U2.4)
FMC_D2: MICRO (U1.114), SD_RAM (U2.5)
FMC_D3: MICRO (U1.115), SD_RAM (U2.7)
FMC_D4: MICRO (U1.58), SD_RAM (U2.8)
FMC_D5: MICRO (U1.59), SD_RAM (U2.10)
FMC_D6: MICRO (U1.60), SD_RAM (U2.11)
FMC_D7: MICRO (U1.63), SD_RAM (U2.13)
FMC_D8: MICRO (U1.64), SD_RAM (U2.42)
FMC_D9: MICRO (U1.65), SD_RAM (U2.44)
FMC_D10: MICRO (U1.66), SD_RAM (U2.45)
FMC_D11: MICRO (U1.67), SD_RAM (U2.47)
FMC_D12: MICRO (U1.68), SD_RAM (U2.48)
FMC_D13: MICRO (U1.77), SD_RAM (U2.50)
FMC_D14: MICRO (U1.78), SD_RAM (U2.51)
FMC_D15: MICRO (U1.79), SD_RAM (U2.53)
FMC_NBL0: MICRO (U1.141), SD_RAM (U2.15)
FMC_NBL1: MICRO (U1.142), SD_RAM (U2.39)
FMC_SDCKE1: MICRO (U1.135), SD_RAM (U2.37)
FMC_SDCLK: MICRO (U1.93), SD_RAM (U2.38)
FMC_SDNCAS: MICRO (U1.132), SD_RAM (U2.17)
FMC_SDNE1: MICRO (U1.136), SD_RAM (U2.19)
FMC_SDNRAS: MICRO (U1.49), SD_RAM (U2.18)
FMC_SDNWE: MICRO (U1.26), SD_RAM (U2.16)
LCD_PWM: MICRO (U1.119), LCD (R25.1 R35.1 U8.4 U13.4)
LED_T_1: MICRO (U1.1), POWER (R53.1)
LED_T_2: MICRO (U1.2), POWER (R54.1)
LED_T_3: MICRO (U1.3), POWER (R55.1)
LTDC_B3: MICRO (U1.126), LCD (J5.24 J8.16)
LTDC_B4: MICRO (U1.127), LCD (J5.25 J8.15)
LTDC_B5: MICRO (U1.37), LCD (J5.26 J8.14)
LTDC_B6: MICRO (U1.139), LCD (J5.27 J8.13)
LTDC_B7: MICRO (U1.140), LCD (J5.28 J8.12)
LTDC_CLK: MICRO (U1.92), LCD (J5.30 J8.37)
LTDC_DE: MICRO (U1.22), LCD (J5.34 J8.9)
LTDC_G2: MICRO (U1.42), LCD (J5.15 J8.25)
LTDC_G3: MICRO (U1.125), LCD (J5.16 J8.24)
LTDC_G4: MICRO (U1.69), LCD (J5.17 J8.23)
LTDC_G5: MICRO (U1.70), LCD (J5.18 J8.22)
LTDC_G6: MICRO (U1.97), LCD (J5.19 J8.21)
LTDC_G7: MICRO (U1.117), LCD (J5.20 J8.20)
LTDC_HSYNC: MICRO (U1.96), LCD (J5.32 J8.11)
LTDC_R3: MICRO (U1.46), LCD (J5.8 J8.32)
LTDC_R4: MICRO (U1.103), LCD (J5.9 J8.31)
LTDC_R5: MICRO (U1.104), LCD (J5.10 J8.30)
LTDC_R6: MICRO (U1.47), LCD (J5.11 J8.29)
LTDC_R7: MICRO (U1.91), LCD (J5.12 J8.28)
LTDC_VSYNC: MICRO (U1.40), LCD (J5.33 J8.10)
SDIO_CK: MICRO (U1.113), STORAGE (J4.5)
SDIO_CMD: MICRO (U1.116), STORAGE (J4.3 R21.1)
SDIO_D0: MICRO (U1.98), STORAGE (J4.7 R19.1)
SPI2_MISO: MICRO (U1.28), STORAGE (U7.8)
SPI2_MOSI: MICRO (U1.29), STORAGE (U7.1)
SPI2_SCK: MICRO (U1.74), STORAGE (U7.2)
SPI5_CSK: MICRO (U1.19), LCD (U9.16)
SPI5_MISO: MICRO (U1.20), LCD (U9.12)
SPI5_MOSI: MICRO (U1.21), LCD (U9.14)
TOUCH_CS: MICRO (U1.118), LCD (U9.15)
TOUCH_INT: MICRO (U1.123), LCD (U9.11)